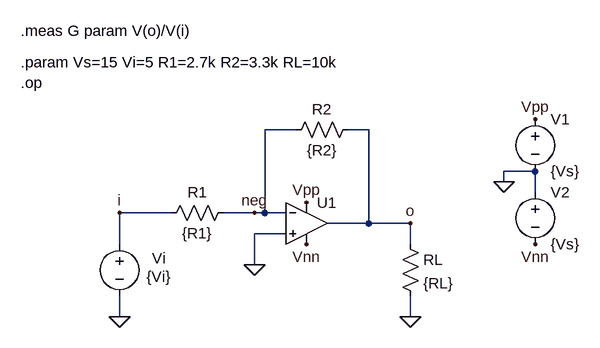
[diagram p0: schematic nideal01op.asc]
nideal01op.asc, the LTspice schematic file:
Version 4
SHEET 1 968 680
WIRE 144 80 96 80
WIRE 256 80 224 80
WIRE 512 144 464 144
WIRE 464 160 464 144
WIRE 512 176 512 144
WIRE -48 208 -128 208
WIRE 80 208 32 208
WIRE 96 208 96 80
WIRE 96 208 80 208
WIRE 128 208 96 208
WIRE 256 224 256 80
WIRE 256 224 192 224
WIRE 320 224 256 224
WIRE 128 240 80 240
WIRE -128 256 -128 208
WIRE 320 256 320 224
WIRE 80 288 80 240
WIRE -128 368 -128 336
WIRE 320 368 320 336
FLAG 512 64 Vpp
FLAG 464 160 0
FLAG 512 256 Vnn
FLAG 320 368 0
FLAG -128 368 0
FLAG 160 192 Vpp
FLAG 160 256 Vnn
FLAG 80 288 0
FLAG 320 224 o
FLAG -128 208 i
FLAG 80 208 neg
SYMBOL voltage 512 48 R0
WINDOW 123 0 0 Left 0
WINDOW 39 0 0 Left 0
SYMATTR InstName V1
SYMATTR Value {Vs}
SYMBOL voltage 512 160 R0
WINDOW 123 0 0 Left 0
WINDOW 39 0 0 Left 0
SYMATTR InstName V2
SYMATTR Value {Vs}
SYMBOL res 304 240 R0
SYMATTR InstName RL
SYMATTR Value {RL}
SYMBOL voltage -128 240 R0
WINDOW 3 42 66 Left 2
WINDOW 123 0 0 Left 0
WINDOW 39 0 0 Left 0
WINDOW 0 50 38 Left 2
SYMATTR Value {Vi}
SYMATTR InstName Vi
SYMBOL Opamps\\UniversalOpamp2 160 224 R0
SYMATTR InstName U1
SYMBOL res -64 224 R270
WINDOW 0 32 56 VTop 2
WINDOW 3 0 56 VBottom 2
SYMATTR InstName R1
SYMATTR Value {R1}
SYMBOL res 128 96 R270
WINDOW 0 32 56 VTop 2
WINDOW 3 0 56 VBottom 2
SYMATTR InstName R2
SYMATTR Value {R2}
TEXT -280 -24 Left 2 !.param Vs=15 Vi=5 R1=2.7k R2=3.3k RL=10k
TEXT -280 8 Left 2 !.op
TEXT -280 -72 Left 2 !.meas G param V(o)/V(i)

The netlist it stands for:
* nideal01op.asc
V1 Vpp 0 {Vs}
V2 0 Vnn {Vs}
RL o 0 {RL}
Vi i 0 {Vi}
XU1 0 neg Vpp Vnn o level.2 Avol=1Meg GBW=10Meg Slew=10Meg ilimit=25m rail=0 Vos=0 phimargin=45 en=0 enk=0 in=0 ink=0 Rin=500Meg  ; pins IN+ IN- V+ V- OUT
R1 i neg {R1}
R2 neg o {R2}
.param Vs=15 Vi=5 R1=2.7k R2=3.3k RL=10k
.op
.meas G param V(o)/V(i)
.lib UniversalOpamps2.sub
.backanno
.end